# EAGLE design RollerShutterNode_nrf (EAGLE 6.5.0)
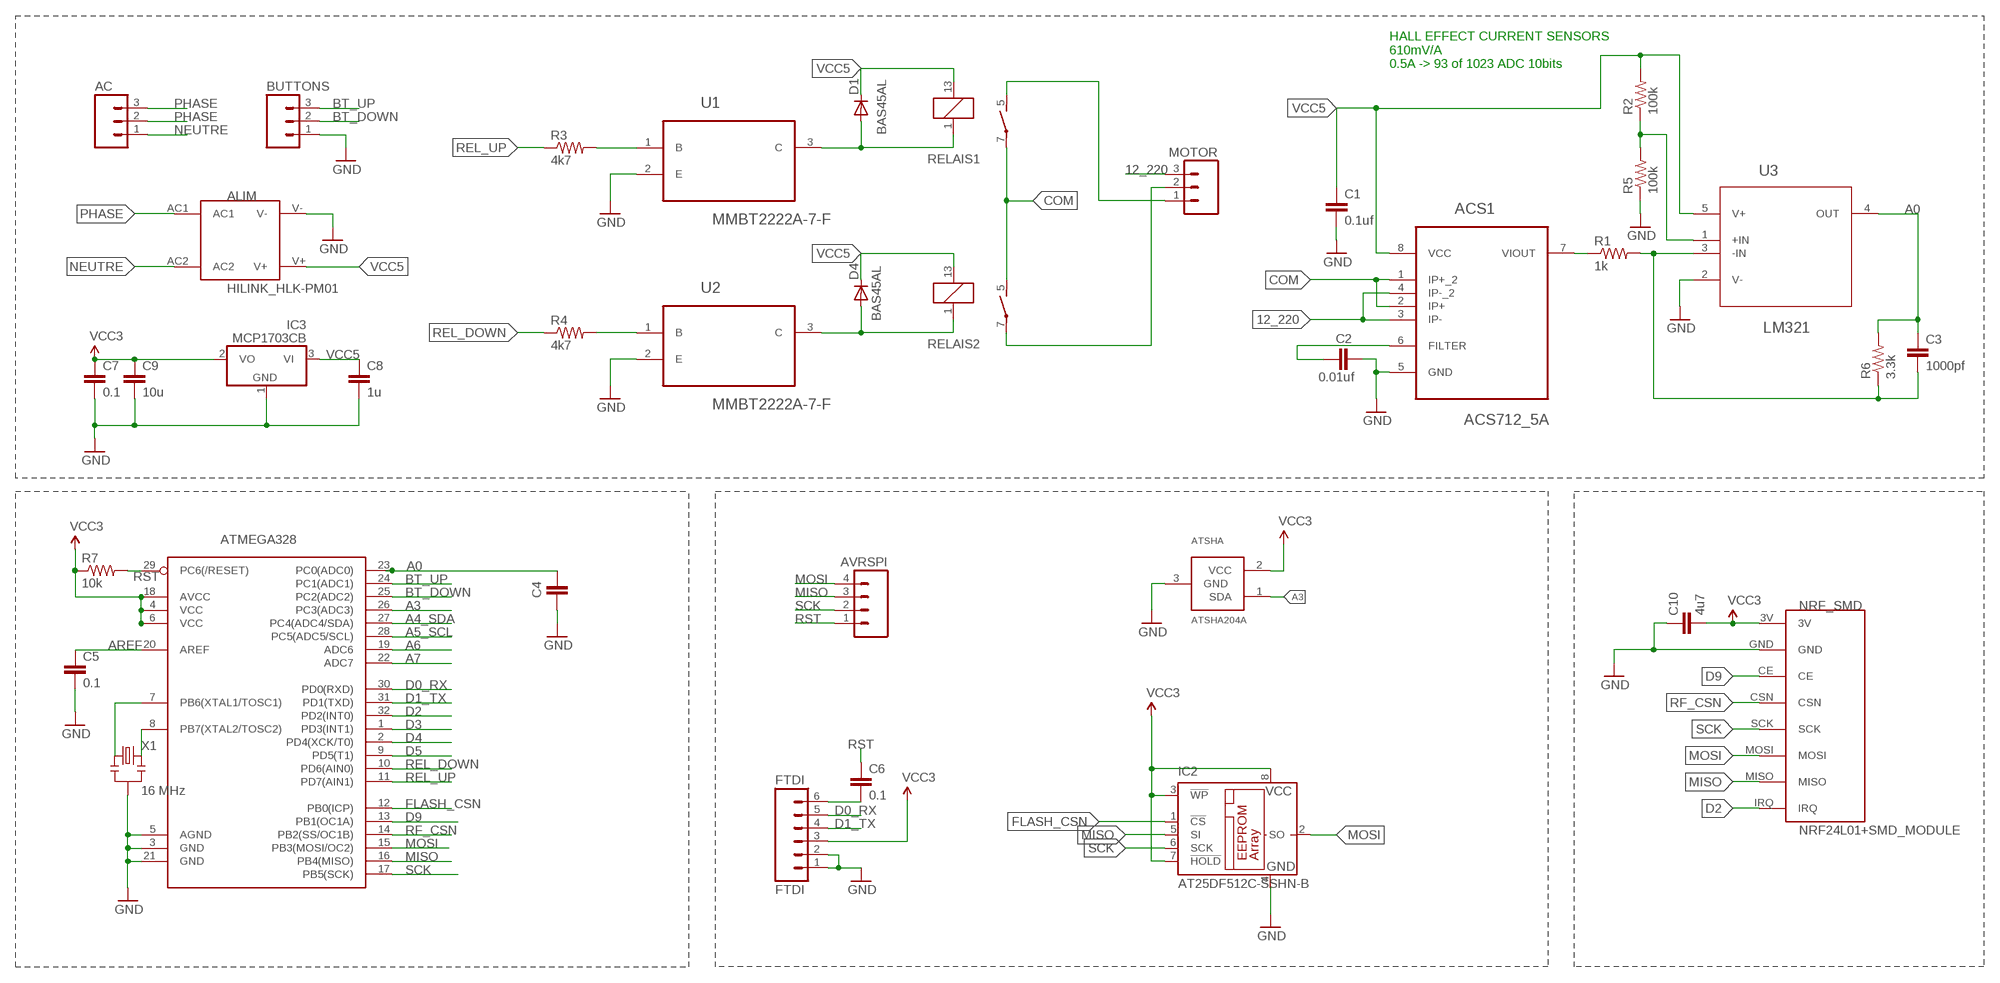
[diagram p0: schematic, sheet 1]

## Parts
AC  M03SCREW  [SCREWTERMINAL-3.5MM-3]
ACS1  ACS712_5A  ACS712ELCTR-20A-T  [SOIC127P600X175-8N]
ALIM  HILINK_HLK-PM01  [HILINK_HLK-PM01]
ATMEGA328  ATMega-328  ATMEGA168/328TQFP32  [TQFP32-08]
ATSHA  ATSHA204A  [SOT23]
AVRSPI  M04PTH  [1X04]
BUTTONS  M03SCREW  [SCREWTERMINAL-3.5MM-3]
C1  0.1uf  CAP0805  [0805]
C2  0.01uf  CAP0805  [0805]
C3  1000pf  CAP0805  [0805]
C4  CAP0805  [0805]
C5  0.1  CAP0805  [0805]
C6  0.1  CAP0805  [0805]
C7  0.1  CAP0805  [0805]
C8  1u  CAP0805  [0805]
C9  10u  CAP0805-CAP  [0805-CAP]
C10  4u7  CAP0805  [0805]
D1  BAS45AL  DIODE-SOD80C  [SOD80C]
D4  BAS45AL  DIODE-SOD80C  [SOD80C]
FTDI  FTDI  M06SIP  [1X06]
IC2  AT25DF512C-SSHN-B  25AA080SN  [SO-08]
IC3  MCP1703CB  [SOT23]
MOTOR  M03SCREW  [SCREWTERMINAL-3.5MM-3]
NRF_SMD  NRF24L01+SMD_MODULE  [NRF24L01+SMD_MODULE]
R1  1k  RESISTOR0805-RES  [0805]
R2  100k  RESISTOR0805-RES  [0805]
R3  4k7  RESISTOR0805-RES  [0805]
R4  4k7  RESISTOR0805-RES  [0805]
R5  100k  RESISTOR0805-RES  [0805]
R6  3.3k  RESISTOR0805-RES  [0805]
R7  10k  RESISTOR0805  [0805]
RELAIS1  Relais G6D  G6D-1A-ASI12VDC  [G6D]
RELAIS2  Relais G6D  G6D-1A-ASI12VDC  [G6D]
U1  MMBT2222A-7-F  [SOT103P240X110-3N]
U2  MMBT2222A-7-F  [SOT103P240X110-3N]
U3  LM321  LM321MF  [SOT95P285X120-5N]
X1  16 MHz  RESONATORSMD  [RESONATOR-SMD]

## Nets
12_220: ACS1.3(IP-) ACS1.4(IP-_2) MOTOR.3
A0: ATMEGA328.23(PC0(ADC0)) C3.1 C4.2 R6.2 U3.4(OUT)
A3: ATMEGA328.26(PC3(ADC3)) ATSHA.1(SDA)
A4_SDA: ATMEGA328.27(PC4(ADC4/SDA))
A5_SCL: ATMEGA328.28(PC5(ADC5/SCL))
A6: ATMEGA328.19(ADC6)
A7: ATMEGA328.22(ADC7)
AREF: ATMEGA328.20(AREF) C5.1
BT_DOWN: ATMEGA328.25(PC2(ADC2)) BUTTONS.2
BT_UP: ATMEGA328.24(PC1(ADC1)) BUTTONS.3
COM: ACS1.1(IP+_2) ACS1.2(IP+) RELAIS1.7(2:P) RELAIS2.5(2:S)
D0_RX: ATMEGA328.30(PD0(RXD)) FTDI.5
D1_TX: ATMEGA328.31(PD1(TXD)) FTDI.4
D2: ATMEGA328.32(PD2(INT0)) NRF_SMD.IRQ
D3: ATMEGA328.1(PD3(INT1))
D4: ATMEGA328.2(PD4(XCK/T0))
D5: ATMEGA328.9(PD5(T1))
D9: ATMEGA328.13(PB1(OC1A)) NRF_SMD.CE
FLASH_CSN: ATMEGA328.12(PB0(ICP)) IC2.1(!CS)
GND: ACS1.5(GND) ALIM.V- ATMEGA328.3(GND) ATMEGA328.5(AGND) ATMEGA328.21(GND) ATSHA.3(GND) BUTTONS.1 C1.2 C2.2 C4.1 C5.2 C7.2 C8.2 C9.2 C10.1 FTDI.1 FTDI.2 IC2.4(GND) IC3.1(GND) NRF_SMD.GND R5.1 U1.2(E) U2.2(E) U3.2(V-) X1.2
MISO: ATMEGA328.16(PB4(MISO)) AVRSPI.3 IC2.5(SI) NRF_SMD.MISO
MOSI: ATMEGA328.15(PB3(MOSI/OC2)) AVRSPI.4 IC2.2(SO) NRF_SMD.MOSI
N$1: ACS1.6(FILTER) C2.1
N$3: ACS1.7(VIOUT) R1.1
N$4: R3.2 U1.1(B)
N$5: R4.2 U2.1(B)
N$6: D4.A RELAIS2.1 U2.3(C)
N$7: MOTOR.1 RELAIS1.5(2:S)
N$8: D1.A RELAIS1.1 U1.3(C)
N$9: MOTOR.2 RELAIS2.7(2:P)
N$10: C3.2 R1.2 R6.1 U3.3(-IN)
N$11: R2.1 R5.2 U3.1(+IN)
N$12: ATMEGA328.7(PB6(XTAL1/TOSC1)) X1.1
N$20: C6.2 FTDI.6
N$21: ATMEGA328.8(PB7(XTAL2/TOSC2)) X1.3
NEUTRE: AC.1 ALIM.AC2
PHASE: AC.2 AC.3 ALIM.AC1
REL_DOWN: ATMEGA328.10(PD6(AIN0)) R4.1
REL_UP: ATMEGA328.11(PD7(AIN1)) R3.1
RF_CSN: ATMEGA328.14(PB2(SS/OC1B)) NRF_SMD.CSN
RST: ATMEGA328.29(PC6(/RESET)) AVRSPI.1 C6.1 R7.2
SCK: ATMEGA328.17(PB5(SCK)) AVRSPI.2 IC2.6(SCK) NRF_SMD.SCK
VCC: ATMEGA328.4(VCC) ATMEGA328.6(VCC) ATMEGA328.18(AVCC) ATSHA.2(VCC) C7.1 C9.1 C10.2 FTDI.3 IC2.3(!WP) IC2.7(!HOLD) IC2.8(VCC) IC3.2(VO) NRF_SMD.3V R7.1 ; supply symbol labelled VCC3
VCC5: ACS1.8(VCC) ALIM.V+ C1.1 C8.1 D1.C D4.C IC3.3(VI) R2.2 RELAIS1.13 RELAIS2.13 U3.5(V+)

## Notes on the sheet
- HALL EFFECT CURRENT SENSORS
  610mV/A
  0.5A -> 93 of 1023 ADC 10bits

## Library data of the parts
AC BUTTONS MOTOR = SparkFun-Connectors:M03: Header 3 Standard 3-pin 0.1" header. Use with straight break away headers (SKU : PRT-00116), right angle break away headers (PRT-00553), swiss pins (PRT-00743), machine pins (PRT-00117), and female headers (PRT-00115). Molex polarized connector foot print use with SKU : PRT-08232 with associated crimp pins and housings.
ACS1 = pmo_lib:ACS712ELCTR-20A-T: Linear Current Sensor; MPN: ACS712ELCTR-20A-T; OC_FARNELL: 1329624; OC_NEWARK: 31M3133; PACKAGE: SOIC-8; SUPPLIER: Allegro
ALIM = pmo_lib:HILINK_HLK-PM01
ATMEGA328 = LowPowerLab:ATMEGA168/328: Atmel 32-pin 8-bit micro, 16k flash.; EAGLEUP: TQFP32-08
ATSHA = Sensor_tbowmo:ATSHA204A
AVRSPI = SparkFun-Connectors:M04: Header 4 Standard 4-pin 0.1" header. Use with straight break away headers (SKU : PRT-00116), right angle break away headers (PRT-00553), swiss pins (PRT-00743), machine pins (PRT-00117), and female headers (PRT-00115). Molex polarized connector foot print use with SKU : PRT-08231 with associated crimp pins and housings. 1MM SMD Version SKU: PRT-10208
C1-C4 = SparkFun-Passives:CAP: Capacitor Standard 0603 ceramic capacitor, and 0.1" leaded capacitor.
C5-C9 = LowPowerLab:CAP: Capacitor Standard 0603 ceramic capacitor, and 0.1" leaded capacitor.
C10 = SparkFun-Capacitors:CAP: Capacitor Standard 0603 ceramic capacitor, and 0.1" leaded capacitor.
D1 D4 = diode:DIODE-: DIODE
FTDI = SparkFun-Connectors:M06: Header 6 Standard 6-pin 0.1" header. Use with straight break away headers (SKU : PRT-00116), right angle break away headers (PRT-00553), swiss pins (PRT-00743), machine pins (PRT-00117), and female headers (PRT-00115). Molex polarized connector foot print use with SKU : PRT-08094 with associated crimp pins and housings. NOTES ON THE VARIANTS LOCK and LOCK_LONGPADS... This footprint was designed to help hold the alignment of a through-hole component (i.e. 6-pin header) while soldering it into place. You may notice that each hole has been shifted either up or down by 0.005 of an inch from it's more standard position (which is a perfectly straight line). This slight alteration caused the pins (the squares in the middle) to touch the edges of the holes. Because they are alternating, it causes a "brace" to hold the component in place. 0.005 has proven to be the perfect amount of "off-center" position when using our standard breakaway headers. Although looks a little odd when you look at the bare footprint, once you have a header in there, the alteration is very hard to notice. Also, if you push a header all the way into place, it is covered up entirely on the bottom side. This idea of altering the position of holes to aid alignment will be further integrated into the Sparkfun Library for other footprints. It can help hold any component with 3 or more connection pins.
IC2 = microchip:25*: Serial EEPROM 4K/ 8K , SPI bus; MF: MICROCHIP; MPN: 25AA080/SN; OC_FARNELL: 1816072; OC_NEWARK: 92C7351
IC3 = linear:MCP1703: 250 mA, 16V, Low Quiescent Current LDO Regulator Source: http://ww1.microchip.com/downloads/en/DeviceDoc/22049b.pdf
NRF_SMD = pmo_lib:NRF24L01+SMD_MODULE
R1-R6 = SparkFun-Resistors:RESISTOR: Resistor Basic schematic elements and footprints for 0603, 1206, and PTH resistors.
R7 = LowPowerLab:RESISTOR: Resistor Basic schematic elements and footprints for 0603, 1206, and PTH resistors.
RELAIS1 RELAIS2 = relay:G6D?*: OMRON Slim, Miniature PCB Relay 17.5 × 6.5 × 12.5 mm with Socked Source: http://ecb.omron.com.sg/pdf/relay/power/G6D.pdf
U1 U2 = pmo_lib:MMBT2222A-7-F: NPN SMALL SIGNAL SURFACE MOUNT TRANSISTOR; MPN: MMBT2222A-7-F; OC_FARNELL: 1773626; OC_NEWARK: 51R6809; PACKAGE: SOT-23-3; SUPPLIER: DIODES INC.
U3 = pmo_lib:LM321MF: Low Power Single Op Amp; MPN: LM321MF; OC_FARNELL: 9779116; OC_NEWARK: 37K8530; PACKAGE: SOT-23-5; SUPPLIER: National Semiconductors
X1 = SparkFun:RESONATOR: Resonator Small SMD resonator. This is the itty bitty 10/20MHz resonators with built in caps. CSTCE10M0G55 and CSTCE20M0V53. Footprint has been reviewed closely but hasn't been tested yet.

## Net classes
1 Power: width 0.406 mm

## Board
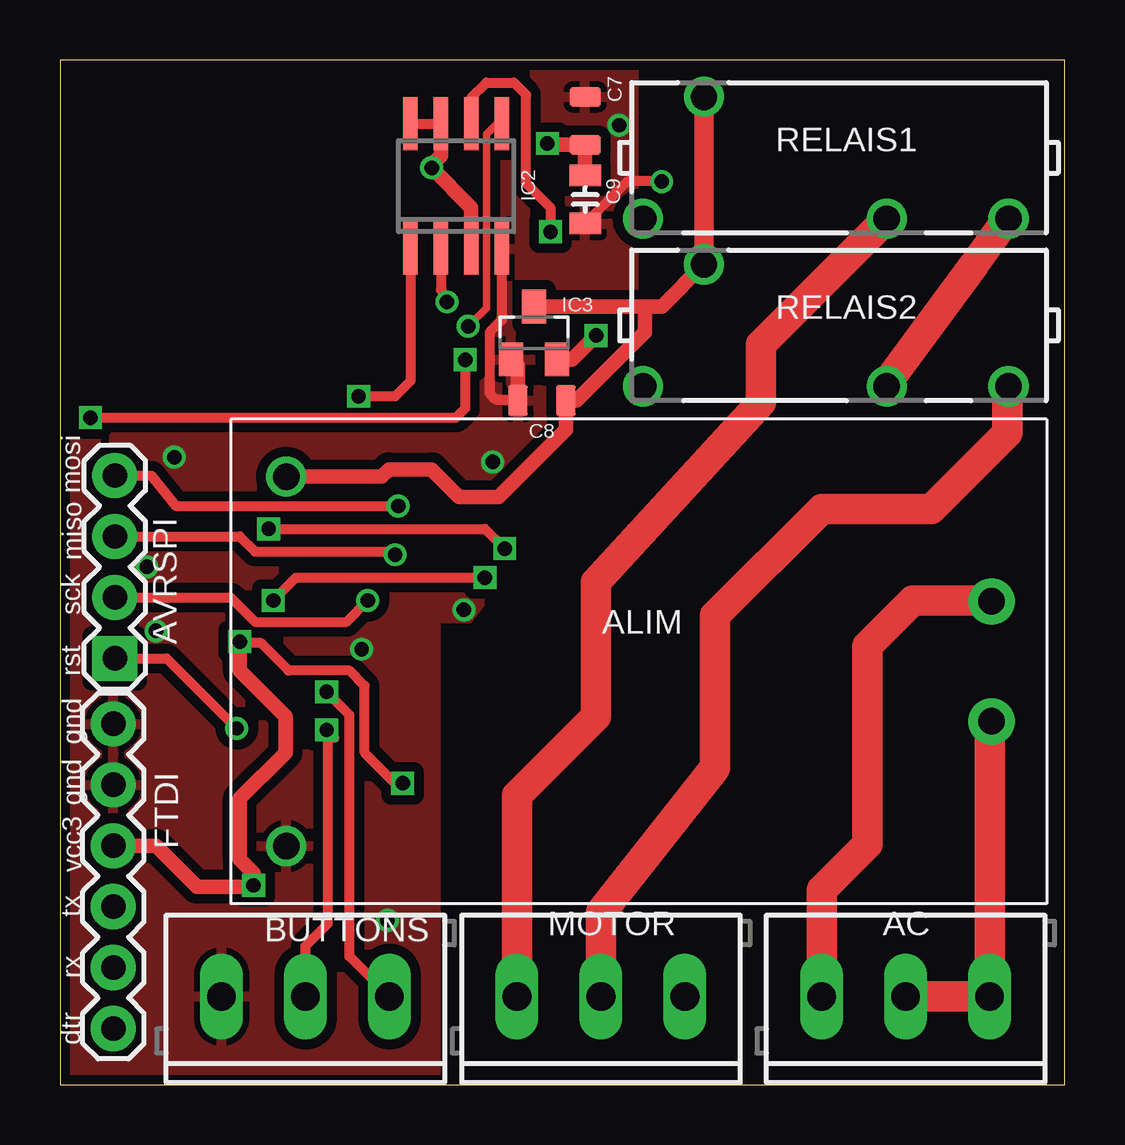
[diagram p1: board, top side]
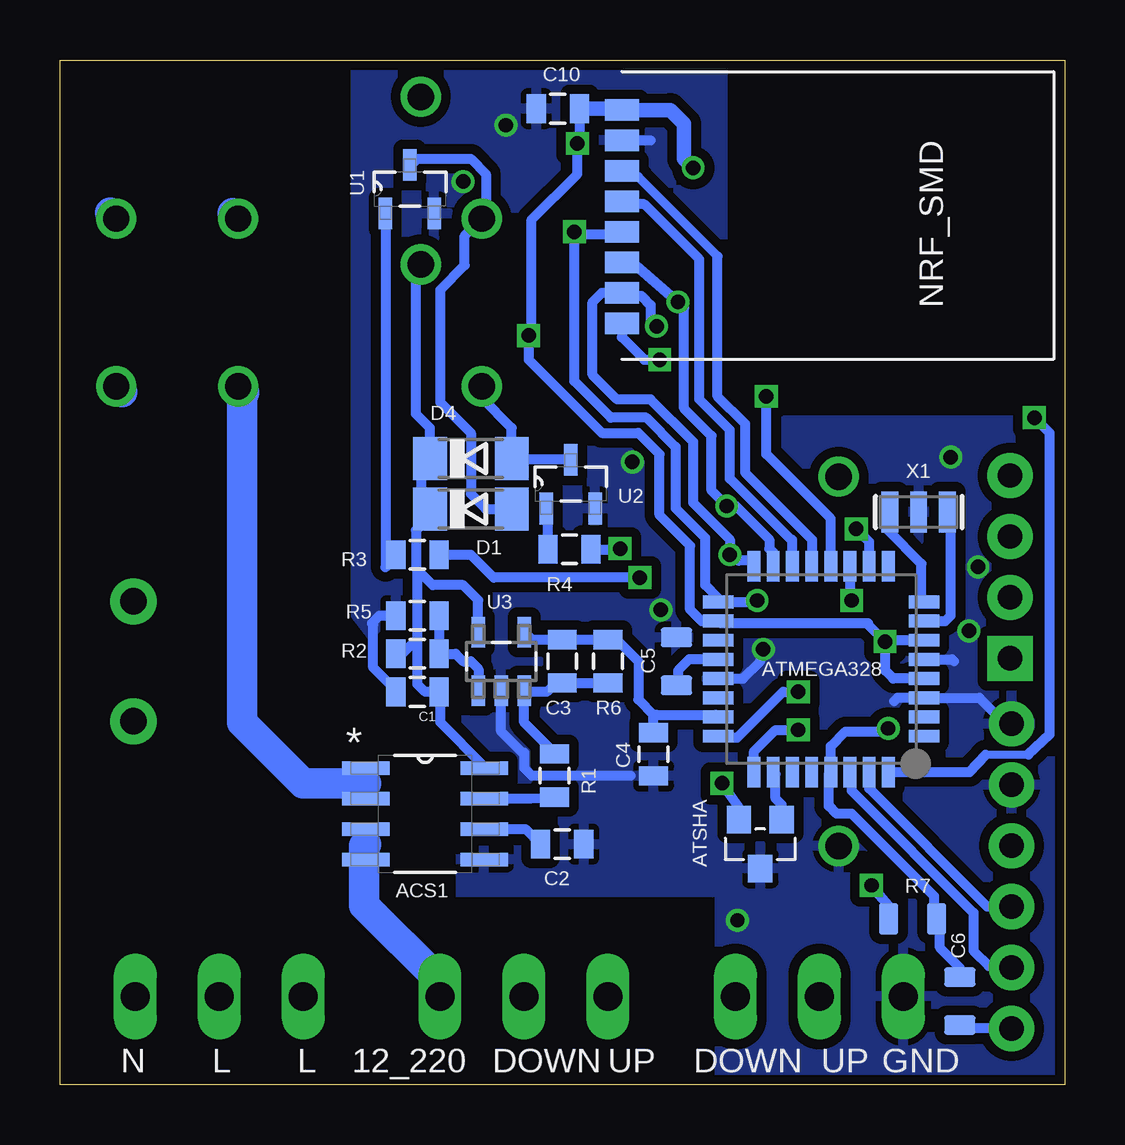
[diagram p2: board, bottom side, seen from below]

Size 41.89 x 42.72 mm. Coordinates in mm from the lower left corner, seen from the top.
Outline: 0,0 41.89,0 41.89,42.72 0,42.72 0,0
Copper layers (1*16): Top 0.0356mm / dielectric 1.5011mm / Bottom 0.0356mm
Design rules "LaenPCBOrder": minimum track width 6mil, minimum drill 13mil, track to track 6mil, track to pad 6mil, pad to pad 6mil, via to via 6mil, smd to smd 6mil, copper to edge 15mil, drill to drill 6mil, minimum pad ring 7mil, minimum via ring 7mil, stop-mask expansion 3mil, vias tented up to drill 0mil, thermal gap 10mil

### Footprints (pad centres in the part's own frame; a part is rotated, then mirrored left to right if it is on the bottom)
SCREWTERMINAL-3.5MM-3 = drill 1.2 pad 1.676 long: 1 0,0; 2 3.5,0; 3 7,0
SOIC127P600X175-8N = smd 1.981 x 0.559: 1 -2.464,1.905; 2 -2.464,0.635; 3 -2.464,-0.635; 4 -2.464,-1.905; 5 2.464,-1.905; 6 2.464,-0.635; 7 2.464,0.635; 8 2.464,1.905
HILINK_HLK-PM01 = drill 1.1 pad 1.93: AC1 2.5,14.7; AC2 -2.5,14.7 | drill 1.1 pad 1.676: V+ -7.7,-14.7; V- 7.7,-14.7
TQFP32-08 = smd 1.27 x 0.533: 1 -4.293,2.8; 2 -4.293,2; 3 -4.293,1.2; 4 -4.293,0.4; 5 -4.293,-0.4; 6 -4.293,-1.2; 7 -4.293,-2; 8 -4.293,-2.8; 17 4.293,-2.8; 18 4.293,-2; 19 4.293,-1.2; 20 4.293,-0.4; 21 4.293,0.4; 22 4.293,1.2; 23 4.293,2; 24 4.293,2.8 | smd 0.533 x 1.27: 9 -2.8,-4.293; 10 -2,-4.293; 11 -1.2,-4.293; 12 -0.4,-4.293; 13 0.4,-4.293; 14 1.2,-4.293; 15 2,-4.293; 16 2.8,-4.293; 25 2.8,4.293; 26 2,4.293; 27 1.2,4.293; 28 0.4,4.293; 29 -0.4,4.293; 30 -1.2,4.293; 31 -2,4.293; 32 -2.8,4.293
SOT23 = smd 1.016 x 1.143: 1 -0.889,-1.016; 2 0.889,-1.016; 3 0,1.016
1X04 = drill 1.016 pad 1.88 square: 1 0,0 | drill 1.016 pad 1.88: 2 2.54,0; 3 5.08,0; 4 7.62,0
0805 = smd 0.8 x 1.2: 1 -0.9,0; 2 0.9,0
0805' = smd 0.8 x 1.3: 1 -1,0; 2 1,0
0805-CAP = smd 0.902 x 1.3: 1 -1,0; 2 1,0
SOD80C = smd 1.4 x 1.8: A 1.7,0; C -1.7,0
1X06 = drill 1.016 pad 1.88: 1 0,0; 2 2.54,0; 3 5.08,0; 4 7.62,0; 5 10.16,0; 6 12.7,0
SO-08 = smd 0.6 x 2.2: 1 -1.905,-2.6; 2 -0.635,-2.6; 3 0.635,-2.6; 4 1.905,-2.6; 5 1.905,2.6; 6 0.635,2.6; 7 -0.635,2.6; 8 -1.905,2.6
SOT23' = smd 1 x 1.4: 1 -0.95,-1.1; 2 0.95,-1.1; 3 0,1.1
NRF24L01+SMD_MODULE = smd 0.9 x 1.4: 3V -4.8,-9.6; CE -2.26,-9.6; CSN -0.99,-9.6; GND -3.53,-9.6; IRQ 4.09,-9.6; MISO 2.82,-9.6; MOSI 1.55,-9.6; SCK 0.28,-9.6
G6D = drill 1.1 pad 1.676: 1 8.08,2.5; 5 -2.08,2.5; 7 -7.16,2.5; 13 5.54,-2.58
SOT103P240X110-3N = smd 1.321 x 0.559: 1 -1.016,1.016; 2 -1.016,-1.016; 3 1.016,0
SOT95P285X120-5N = smd 1.27 x 0.559: 1 -1.219,0.965; 2 -1.219,0; 3 -1.219,-0.965; 4 1.219,-0.965; 5 1.219,0.965
RESONATOR-SMD = smd 0.7 x 1.7: 1 -1.2,0; 2 0,0; 3 1.2,0

### Placement (x,y rotation side)
AC  31.75,3.68 0 top
ACS1  26.67,11.3 0 bottom
ALIM  24.13,17.65 270 top
ATMEGA328  10.16,17.34 180 bottom
ATSHA  12.7,10.03 180 bottom
AVRSPI  2.29,17.78 90 top
BUTTONS  6.73,3.68 0 top
C1  26.99,16.38 180 bottom
C2  20.95,10.03 0 bottom
C3  20.95,17.65 270 bottom
C4  17.14,13.78 90 bottom
C5  0.1  [0805']  16.19,17.65 90 bottom
C6  0.1  [0805']  4.38,3.49 270 bottom
C7  0.1  [0805']  21.89,40.18 90 top
C8  1u  [0805']  20.09,28.52 180 top
C9  21.89,36.91 270 top
C10  21.13,40.69 0 bottom
D1  24.77,24 0 bottom
D4  24.77,26.11 0 bottom
FTDI  2.22,15.05 270 top
IC2  16.51,37.47 0 top
IC3  MCP1703CB  [SOT23']  19.76,31.34 0 top
MOTOR  19.05,3.68 0 top
NRF_SMD  8.86,35.84 270 bottom
R1  21.27,12.89 90 bottom
R2  26.99,17.97 180 bottom
R3  26.99,22.1 180 bottom
R4  20.65,22.33 180 bottom
R5  26.99,19.56 0 bottom
R6  19.05,17.65 90 bottom
R7  10k  [0805']  6.35,6.92 0 bottom
RELAIS1  32.38,38.61 180 top
RELAIS2  32.38,31.62 180 top
U1  27.3,37.34 90 bottom
U2  20.6,25.04 90 bottom
U3  23.5,17.65 90 bottom
X1  6.1,23.88 180 bottom

### Tracks (layer width: path | path; a pad name or v marks a point on that pad's centre or on a via)
12_220
  Bottom 0.406: ACS1.4 29.13,10.03 ACS1.3
  Bottom 1.27: MOTOR.3 26.05,4.33 29.21,7.49 29.21,9.96 29.13,10.03
A0
  Bottom 0.406: U3.4 22.21,18.55 C3.1 R6.2 18.68,18.55 17.78,17.65 17.78,16.07 17.14,15.43 17.04,15.43 | 17.04,15.43 14.55,15.43 ATMEGA328.23 | C4.2 17.14,15.33 17.04,15.43
A3
  Bottom 0.406: ATSHA.1 11.81,11.68 12.06,11.94 12.06,12.95 ATMEGA328.26
AREF
  Bottom 0.406: ATMEGA328.20 15.66,17.74 16.13,17.27 16.13,16.72 C5.1
BT_DOWN  (via drill 0.6)
  Top 0.406: 11.43,14.48 v11.11,14.79 11.18,14.73 11.18,6.73 10.23,5.79 BUTTONS.2
  Bottom 0.406: ATMEGA328.25 12.96,13.9 12.06,14.79 v11.11,14.79
BT_UP  (via drill 0.6)
  Top 0.406: v11.11,16.38 12.06,15.43 12.06,5.35 BUTTONS.3
  Bottom 0.406: ATMEGA328.24 14.51,14.48 13.65,14.48 11.75,16.38 v11.11,16.38
COM
  Top 1.27: RELAIS2.5 34.47,29.26 38.1,34.16 39.37,35.93 RELAIS1.7
  Bottom 0.406: ACS1.2 29.13,12.57 ACS1.1
  Bottom 1.27: 29.13,12.57 31.75,12.57 34.29,15.11 34.29,28.95 RELAIS2.5 34.2,28.86 | 39.79,36.35 RELAIS1.7
D0_RX
  Bottom 0.406: ATMEGA328.30 8.89,12.97 8.89,12.26 3.81,7.17 3.81,5.59 3.17,4.95 2.29,4.95 FTDI.5
D1_TX
  Bottom 0.406: ATMEGA328.31 8.16,12.35 3.24,7.43 FTDI.4
D2  (via drill 0.6)
  Top 0.406: v1.27,27.81 16.51,27.81 16.89,28.19 v16.89,30.23
  Bottom 0.33: 3.3,13.77 1.52,13.77
  Bottom 0.406: ATMEGA328.32 3.98,13.04 3.3,13.77 | 1.52,13.77 0.64,14.61 0.64,27.18 v1.27,27.81 | NRF_SMD.IRQ 18.46,31.16 17.53,30.23 v16.89,30.23
D9
  Bottom 0.305: 18.34,37.97 18.03,37.97
  Bottom 0.356: 14.48,34.54 17.78,37.85
  Bottom 0.406: 14.48,34.54 14.48,28.7 13.34,27.56 13.34,25.53 10.54,22.73 10.54,21.65 ATMEGA328.13 | 17.78,37.85 18.34,37.97 NRF_SMD.CE
FLASH_CSN  (via drill 0.6)
  Top 0.406: IC2.1 14.61,29.34 13.97,28.7 v12.45,28.7
  Bottom 0.406: ATMEGA328.12 9.76,23.6 12.45,26.29 v12.45,28.7
GND  (via drill 0.6)
  Top 0.406: C9.2 23.66,37.67 25.07,37.67 v25.08,37.66 | IC2.4 18.41,31.88 17.91,31.37 17.91,28.83 18.16,28.57 19.04,28.57 C8.2
  Top 0.61: C8.2 19.09,29.96 IC3.1
  Bottom 0.406: C1.2 27.94,16.38 27.94,16.51 28.83,17.4 28.83,19.18 28.89,19.24 28.57,19.56 R5.1 | ATMEGA328.21 13.42,16.94 12.7,17.65 v12.57,18.16 | 18.1,12.89 22.23,12.89 22.54,13.21 22.54,13.84 22.61,13.84 23.5,14.73 23.5,16.38 | FTDI.1 2.29,15.11 2.54,15.11 3.56,16.14 ATMEGA328.3 6.98,16.14 7.11,16 | ATMEGA328.5 4.71,17.74 4.62,17.65 | NRF_SMD.GND 17.27,39.37
  other vias: 13.65,6.86 18.03,25.97 16.84,19.8 4.76,26.16 23.3,40.01 4,18.92 3.62,21.59
  pour Top (isolate 0.406): -2.54,44.32 44.45,44.32 44.45,-1.4 -2.54,-1.4
  pour Bottom (isolate 0.406, rank 6): -5.08,46.86 46.99,46.86 46.99,-3.94 -5.08,-3.94
MISO  (via drill 0.6)
  Top 0.305: IC2.5 18.41,40.26 17.78,39.62 17.78,32.38 v17.02,31.62
  Top 0.406: AVRSPI.3 7.49,22.86 8.13,22.23 13.72,22.23 v13.97,22.1
  Bottom 0.406: ATMEGA328.16 12.96,21.85 13.6,21.85 v13.97,22.1 13.97,22.73 15.49,24.26 15.49,26.8 17.27,28.57 18.67,28.57 19.68,29.59 19.68,32.64 19.3,33.02 NRF_SMD.MISO | NRF_SMD.MISO 18.34,32.89 17.65,32.89 17.27,32.51 17.27,31.88 v17.02,31.62 | 18.59,32.89 NRF_SMD.MISO
MOSI  (via drill 0.6)
  Top 0.406: AVRSPI.4 3.81,25.4 4.83,24.13 v14.1,24.13 | IC2.2 15.88,33.15 v16.13,32.64
  Bottom 0.406: ATMEGA328.15 12.16,22.19 12.32,22.35 12.32,22.73 13.72,24.13 v14.1,24.13 14.73,24.77 14.73,27.05 15.88,28.19 15.88,32.38 v16.13,32.64 | NRF_SMD.MOSI 18.34,34.16 17.91,34.16 v16.13,32.64 | 16.26,32.51 v16.13,32.64
N$1
  Bottom 0.406: ACS1.6 22.49,10.67 C2.1
N$2
  cutout Bottom: 0.03,42.72 14.05,42.72 14.05,27.91 0.03,27.91
N$3
  Bottom 0.406: ACS1.7 22.28,11.94 R1.1
N$4
  Bottom 0.406: U1.1 28.32,21.58 R3.2
N$5
  Bottom 0.406: R4.2 21.55,23.96 U2.1
N$6
  Bottom 0.406: RELAIS2.1 24.3,28.62 23.07,27.38 D4.A | 22.86,26.05 D4.A | U2.3 23.01,26.06 D4.A
N$7
  Top 1.27: RELAIS1.5 29.21,30.85 29.21,28.45 22.35,20.96 22.35,15.37 19.05,12.07 MOTOR.1
  Bottom 1.27: 34.69,36.33 RELAIS1.5
N$8
  Bottom 0.406: U1.3 27.24,38.35 26.99,38.61 24.77,38.61 24.13,37.97 24.13,36.28 RELAIS1.1 25.02,35.39 25.02,34.16 26.04,33.15 26.04,28.45 24.77,27.18 24.77,24.64 24.13,24 D1.A
N$9
  Top 1.27: MOTOR.2 22.55,7.18 27.3,13.21 27.3,19.56 31.75,24 36.32,24 39.5,27.18 39.5,29.07 RELAIS2.7
  Bottom 1.27: 39.3,28.88 RELAIS2.7
N$10
  Bottom 0.406: R6.1 C3.2 21.22,16.75 21.59,16.38 22.48,16.38 U3.3 22.54,16.42 22.54,15.11 21.27,13.84 R1.2
N$11
  Bottom 0.406: R5.2 R2.1 25.4,17.97 25.08,17.65 24.77,17.65 24.45,17.34 24.45,16.45 U3.1
N$12
  Bottom 0.406: ATMEGA328.7 4.99,19.34 4.76,19.56 4.76,23.74 X1.1
N$14
  cutout Top: 24.13,42.42 41.27,42.42 41.27,0 15.88,0 15.88,19.24 17.14,19.24 24.13,28.13
  cutout Top: 24.13,42.42 41.27,42.42 41.27,0 15.88,0 15.88,19.24 17.14,19.24 24.13,28.13
N$15
  cutout Bottom: 14.61,0 41.27,0 41.27,42.42 29.78,42.67 29.78,19.49 25.4,13.84 25.4,7.81 14.61,7.81
N$16
  cutout Top: 0,42.67 14.02,42.67 14.02,28.02 0,28.02
N$20
  Bottom 0.406: FTDI.6 4.24,2.35 C6.2
N$21
  Bottom 0.406: ATMEGA328.8 5.97,20.14 5.97,21.72 7.37,23.11 7.37,23.81 X1.3
NEUTRE
  Top 1.27: AC.1 31.75,8.13 33.66,10.03 33.66,18.29 35.56,20.19 38.79,20.19 ALIM.AC2
PHASE
  Top 1.27: AC.2 AC.3 38.75,15.07 ALIM.AC1
REL_DOWN  (via drill 0.6)
  Top 0.406: v8.7,23.18 17.72,23.18 v18.54,22.35
  Bottom 0.406: ATMEGA328.10 8.16,22.64 v8.7,23.18 | R4.1 18.57,22.33 v18.54,22.35
REL_UP  (via drill 0.6)
  Top 0.406: v17.72,21.15 9.84,21.15 v8.89,20.19
  Bottom 0.406: ATMEGA328.11 8.96,20.26 v8.89,20.19 | v17.72,21.15 23.81,21.15 24.77,22.1 R3.1 26.06,22.07
RF_CSN
  Bottom 0.406: ATMEGA328.14 11.36,22.71 11.41,22.71 13.97,25.27 13.97,27.3 15.24,28.57 15.24,34.42 17.53,36.7 18.34,36.7 NRF_SMD.CSN 18.41,36.88
RST  (via drill 0.6)
  Top 0.406: AVRSPI.1 4.45,17.78 v7.37,14.86
  Bottom 0.406: v7.37,14.86 7.49,14.73 9.14,14.73 9.76,14.12 ATMEGA328.29 9.84,12.96 9.84,11.62 9.53,11.3 8.89,11.3 5.46,7.87 5.46,7.03 R7.2 5.21,6.78 5.21,5.71 4.38,4.89 C6.1
SCK  (via drill 0.6)
  Top 0.406: AVRSPI.2 7.11,20.32 8.13,19.3 11.94,19.3 v12.83,20.19 | IC2.6 17.14,41.15 17.78,41.78 18.92,41.78 19.43,41.27 19.43,37.59 20.45,36.58 v20.45,35.56
  Bottom 0.406: v12.83,20.19 12.77,20.14 ATMEGA328.17 14.45,20.3 14.99,20.83 14.99,22.8 16.23,24.04 16.23,26.59 17.45,27.81 18.92,27.81 20.45,29.34 v20.45,35.56 20.32,35.43 18.59,35.43 NRF_SMD.SCK 18.34,35.43
VCC  (via drill 0.6)
  Top 0.406: v14.29,12.57 13.97,12.57 12.7,13.84 12.7,16.64 12.06,17.27 9.53,17.27 8.38,18.41 7.56,18.41 v7.49,18.48 | 20.38,39.18 v20.32,39.24 | 21.83,37.97 C9.1 | IC2.8 IC2.7
  Top 0.61: C9.1 C7.1 20.38,39.18 | IC3.2 21.35,30.24 v22.35,31.24 | IC2.3 17.14,36.58 v15.49,38.23 15.49,38.35 15.88,38.73 IC2.7 | FTDI.3 4,9.97 5.71,8.26 8,8.26 v8.06,8.32 8.06,8.83 7.49,9.4 7.49,11.94 9.4,13.84 9.4,15.37 7.49,17.27 v7.49,18.48
  Bottom 0.406: ATSHA.2 13.59,11.56 v14.29,12.57 | ATMEGA328.4 7.16,16.94 7.49,17.27 v7.49,18.48 | ATMEGA328.6 7.44,18.54 v7.49,18.48 | v7.49,18.48 8.2,19.19 8.2,19.24 14.36,19.24 ATMEGA328.18 15.14,19.34 15.62,19.81 15.62,22.48 16.89,23.75 16.89,26.29 17.78,27.18 19.3,27.18 22.35,30.23 v22.35,31.24 22.23,31.5 22.23,36.07 20.32,37.97 v20.32,39.24 20.23,39.33 C10.2 | R7.1 7.35,7.48 v8.06,8.32
  Bottom 0.61: C10.2 18.46,40.69 NRF_SMD.3V 16.45,40.64 IC2.7 15.88,38.61 v15.49,38.23
VCC5
  Top 0.61: 26.8,34.16 RELAIS2.13 25.09,32.44 24.38,32.44 | ALIM.V+ 13.41,25.35 13.72,25.65 15.49,25.65 16.64,24.51 18.29,24.51 21.09,27.31 C8.1 21.54,28.52 24.38,31.37 24.38,32.44 | IC3.3 24.38,32.44
  Top 0.813: RELAIS1.13 RELAIS2.13
  Bottom 0.406: R2.2 27.62,17.97 26.99,18.61 | 26.99,18.61 26.99,21.46 | 26.99,18.61 26.99,16.7 26.67,16.38 C1.1 26.04,16.33 26.04,15.11 24.21,13.28 ACS1.8 | U3.5 24.46,20.21 25.08,20.83 26.35,20.83 26.99,21.46 | 26.99,21.46 27.05,21.53 27.05,23.11 26.46,23.7 D1.C 26.84,24.38 26.84,25.94 D4.C 26.46,27.38 27.05,27.96 27.05,34 RELAIS2.13

### Text on the board
tNames: mosi | miso | sck | rst | gnd | gnd | vcc3 | tx | rx | dtr
bNames: GND | UP | DOWN | UP | DOWN | 12_220 | L | L | N